# Altium schematic sheet HS_SW.SchDoc
size A4; SheetNumber: 7; SheetTotal: 13
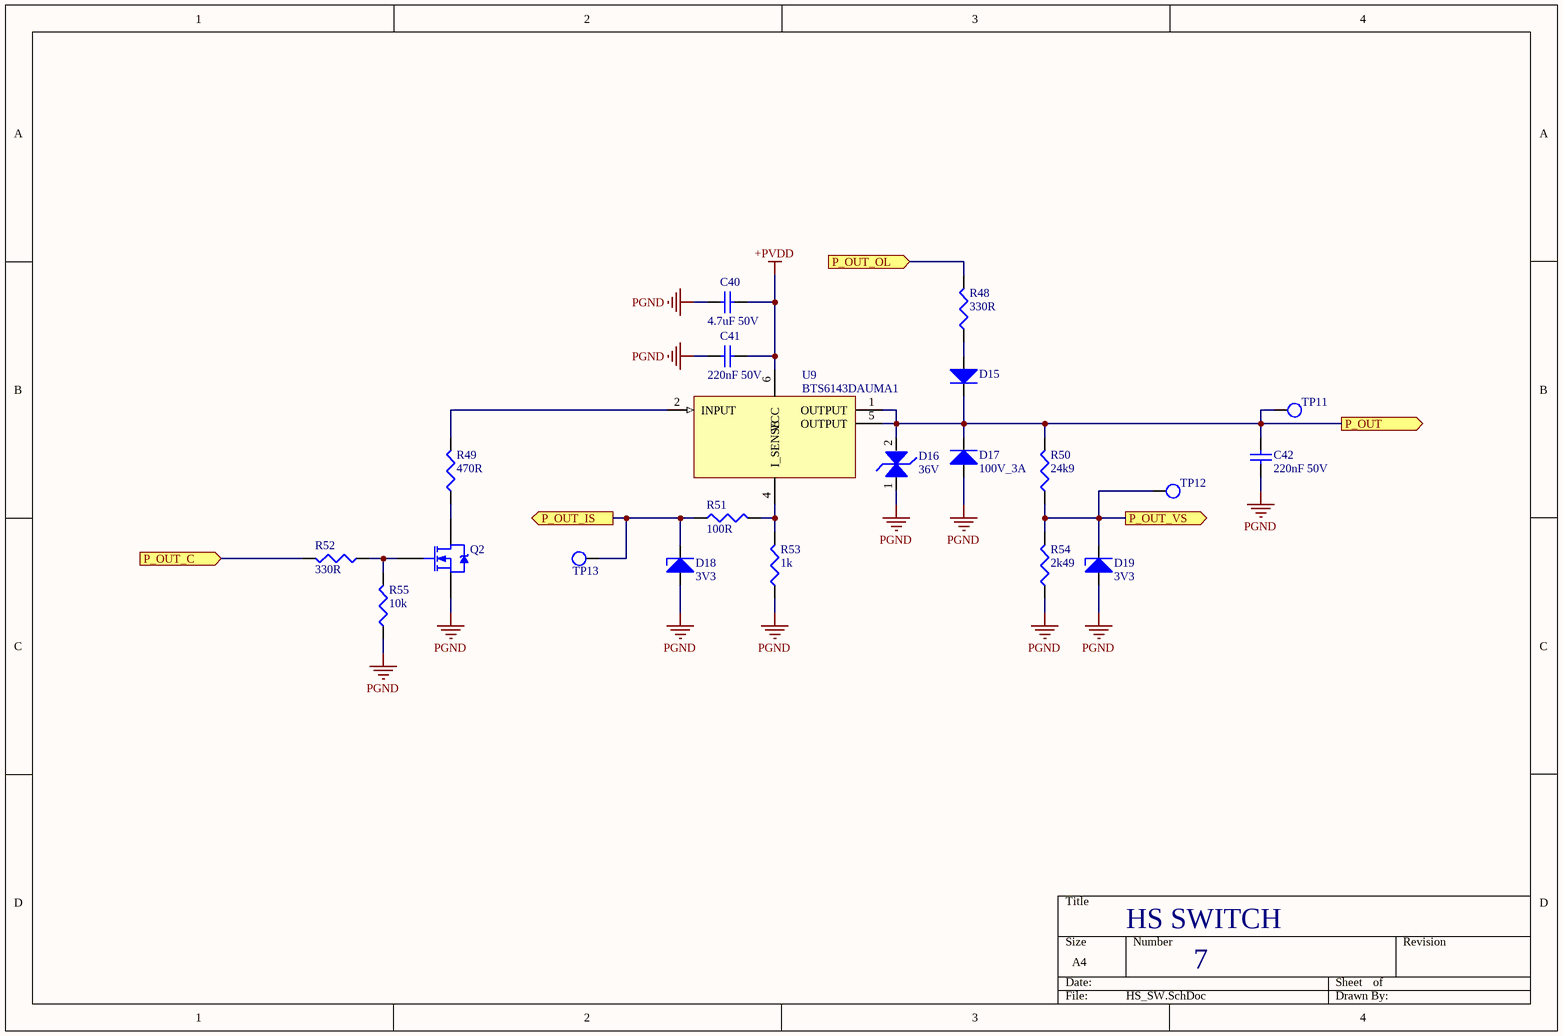
[diagram p0: HS_SW.SchDoc]

## Parts
C40  4.7uF 50V  [CAP1206]
C41  220nF 50V  [CAP1206]
C42  220nF 50V  [CAP1206]
D15  100V 300mA  [SOD123_1N4148W-7-F]  (value not drawn)
D16  36V  [DO214AA]
D17  100V_3A  [DO-221A]
D18  3V3  [SOD323]
D19  3V3  [SOD323]
Q2  60V 360mA  [SOT23_2N7002]  (value not drawn)
R48  330R  [RES0603]
R49  470R  [RES0603]
R50  24k9  [RES0603]
R51  100R  [RES0603]
R52  330R  [RES0603]
R53  1k  [RES0603]
R54  2k49  [RES0603]
R55  10k  [RES0603]
TP11  TEST_POINT  [TEST_POINT_TH]  (value not drawn)  (no BOM)
TP12  TEST_POINT  [TEST_POINT_TH]  (value not drawn)  (no BOM)
TP13  TEST_POINT  [TEST_POINT_TH]  (value not drawn)  (no BOM)
U9  P/N: BTS6143DAUMA1  [TO252-5]  (hidden comment: 33A)

## Ports
P_OUT (out), P_OUT_C (in), P_OUT_IS (out), P_OUT_OL (in), P_OUT_VS (out)

## Nets
+PVDD: C40.2 C41.1 U9.6(VCC)
PGND: C40.1 C41.2 C42.1 D16.1 D17.2(A) D18.2(A) D19.2(A) Q2.2(S) R53.1 R54.1 R55.1
P_OUT: C42.2 D15.2(K) D16.2 D17.1(K) R50.2 TP11.1 U9.1(OUTPUT) U9.5(OUTPUT) ; port P_OUT
P_OUT_C: R52.2 ; port P_OUT_C
P_OUT_IS: D18.1(K) R51.1 TP13.1 ; port P_OUT_IS
P_OUT_OL: R48.2 ; port P_OUT_OL
P_OUT_VS: D19.1(K) R50.1 R54.2 TP12.1 ; port P_OUT_VS
NetD15_1: D15.1(A) R48.1
NetQ2_1: Q2.1(G) R52.1 R55.2
NetQ2_3: Q2.3(D) R49.1
NetR49_2: R49.2 U9.2(INPUT)
NetR51_2: R51.2 R53.2 U9.4(I_SENSE)

## Notes on the sheet
- HS SWITCH

## Library data of the parts
C40 = CAP1206_4.7uF: CAP CER 4.7UF 50V %20 X7R 1206; P/N: GRJ31CR71H475KE11L; Order Code: DIGI : 490-10944-1-ND; Value: 4.7uF 50V
C41 C42 = CAP1206_220nF: CAP CER 0.22UF 50V X7R 1206; P/N: CL31B224KBFNNNE; Order Code: DIGI : CL31B224KBFNNNE; Value: 220nF
D15 = DIODE_1N4148W-7-F: DIODE GEN PURP 100V 300MA SOD123; Order Code: DIGI : 1N4148W-FDICT-ND; P/N: 1N4148W-7-F; Value: 100V 300mA
D16 = SMBJ36CA-TR_TVS_BI_DIR: TVS DIODE 36V DO214AA; Order Code: DIGI : 497-12053-1-ND; P/N: SMBJ36CA-TR; Value: 36V
D17 = FRED_VS-3EYH01-M3/H_100V_3A: DIODE FRED 100V 3A DO-221AD; Value: 100V 3A; Order Code: DIGI : 112-VS-3EYH01-M3/HCT-ND; P/N: VS-3EYH01-M3/H
D18 D19 = ZENER_3V3_MM3Z3V3T1G: DIODE ZENER 3.3V 300MW SOD323; Order Code: DIGI : MM3Z3V3T1GOSCT-ND; P/N: MM3Z3V3T1G; Value: 3V3
Q2 = 2N7002P,215_NMOS_60V: MOSFET N-CH 60V 0.36A SOT-23; Order Code: DIGI : 1727-4692-1-ND; Value: 60V 360mA; P/N: 2N7002P,215
R48 R52 = RES0603_330R: RES 330 OHM 1% 1/10W 0603; Order Code: DIGI : RMCF0603FT330RCT-ND; P/N: RMCF0603FT330R; ART Code: ART0021648; Value: 330R
R49 = RES0603_470R: RES SMD 470 OHM 1% 1/10W 0603; Order Code: DIGI : 311-470HRCT-ND; P/N: RC0603FR-07470RL; ART Code: ART0023387; Value: 470R
R50 = RES0603_24k9: RES SMD 24.9K OHM 1% 1/10W 0603; Order Code: DIGI : P24.9KHCT-ND; P/N: ERJ-3EKF2492V; Value: 24k9
R51 = RES0603_100R: RES SMD 100R OHM 1% 1/10W 0603; Order Code: DIGI : RMCF0603FT100RCT-ND; P/N: RMCF0603FT100R; ART Code: ART0022201; Value: 100R
R53 = RES0603_1k: RES SMD 1K OHM 1% 1/10W 0603; Order Code: DIGI : 311-1.00KHRCT-ND; P/N: RC0603FR-071KL; ART Code: ART0014240; Value: 1k
R54 = RES0603_2k49: RES 2.49K OHM 1% 1/10W 0603; Order Code: DIGI : RMCF0603FT2K49CT-ND; P/N: RMCF0603FT2K49; ART Code: ART0014241; Value: 2k49
R55 = RES0603_10k: RES SMD 10K OHM 5% 1/10W 0603; Order Code: DIGI : 311-10KGRCT-ND; P/N: RC0603JR-0710KL; ART Code: ART0020747; Value: 10k
U9 = PD_SW_BTS6143DAUMA1: IC HIGH SIDE PWR SWITCH DPAK-5; Order Code: DIGI : BTS6143DAUMA1CT-ND; Value: 33A